# Altium schematic sheet Main.SchDoc
size 215 x 152 mm
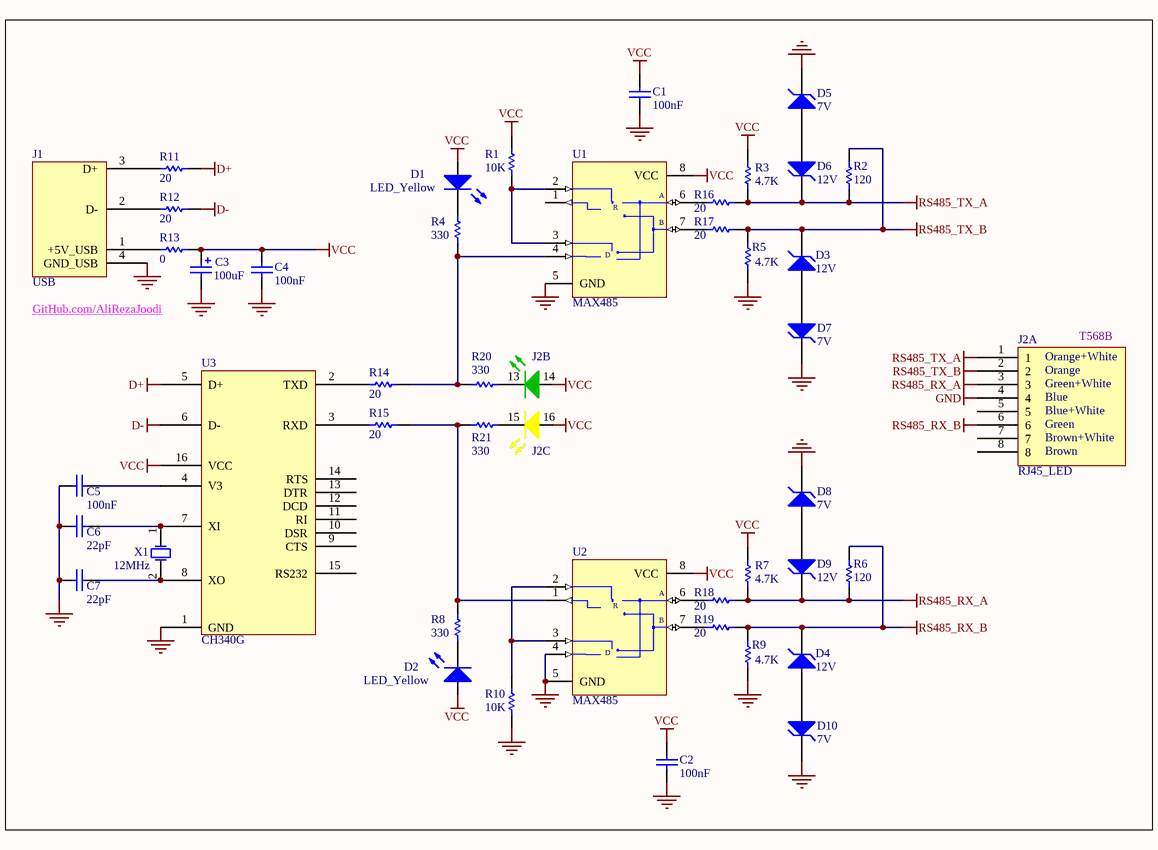
[diagram p0: Main.SchDoc]

## Parts
C1  100nF  [CAPNTO2.54-3.05x1.78A]
C2  100nF  [CAPNTO2.54-3.05x1.78A]
C3  100uF  [CAPPR2.5-6.3x5]
C4  100nF  [CAPNTO2.54-3.05x1.78A]
C5  100nF  [CAPNTO2.54-3.05x1.78A]
C6  22pF  [CAPNTO2.54-3.05x1.78A]
C7  22pF  [CAPNTO2.54-3.05x1.78A]
D1  LED_Yellow  [LED-5mm_Red]
D2  LED_Yellow  [LED-5mm_Red]
D3  12V  [DIODE0.4_Glass]
D4  12V  [DIODE0.4_Glass]
D5  7V  [DIODE0.4_Glass]
D6  12V  [DIODE0.4_Glass]
D7  7V  [DIODE0.4_Glass]
D8  7V  [DIODE0.4_Glass]
D9  12V  [DIODE0.4_Glass]
D10  7V  [DIODE0.4_Glass]
J1  USB  [USB2.5-2H4D]
J2  RJ45_LED  [RJ45-AMP_LED]  (parts A,B,C of 3)
R1  10K  [AXIAL-0.4]
R2  120  [AXIAL-0.4]
R3  4.7K  [AXIAL-0.4]
R4  330  [AXIAL-0.4]
R5  4.7K  [AXIAL-0.4]
R6  120  [AXIAL-0.4]
R7  4.7K  [AXIAL-0.4]
R8  330  [AXIAL-0.4]
R9  4.7K  [AXIAL-0.4]
R10  10K  [AXIAL-0.4]
R11  20  [AXIAL-0.4]
R12  20  [AXIAL-0.4]
R13  0  [AXIAL-0.4]
R14  20  [AXIAL-0.4]
R15  20  [AXIAL-0.4]
R16  20  [AXIAL-0.4]
R17  20  [AXIAL-0.4]
R18  20  [AXIAL-0.4]
R19  20  [AXIAL-0.4]
R20  330  [AXIAL-0.4]
R21  330  [AXIAL-0.4]
U1  MAX485  [PA8]
U2  MAX485  [PA8]
U3  CH340G  [SOIC127P602-16BM]
X1  12MHz  [XTAL_1]

## Nets
D+: R11.1 U3.5(D+)
D-: R12.1 U3.6(D-)
GND: C1.1 C2.1 C3.2 C4.1 C5.1 C6.2 C7.2 D5.2(K) D7.2(K) D8.2(K) D10.2(K) J1.4(GND_USB) J2.4 J2.10(H2) R5.2 R9.2 R10.1 U1.5(GND) U2.4(DI) U2.5(GND) U3.1(GND)
RS485_RX_A: D9.2(K) J2.3 R6.1 R7.2 R18.1
RS485_RX_B: D4.2(K) J2.6 R6.2 R9.1 R19.1
RS485_TX_A: D6.2(K) J2.1 R2.1 R3.2 R16.1
RS485_TX_B: D3.2(K) J2.2 R2.2 R5.1 R17.1
VCC: C1.2 C2.2 C3.1 C4.2 D1.1(A) D2.1(A) J2.14(A1) J2.16(A2) R1.2 R3.1 R7.1 R13.1 U1.8(VCC) U2.8(VCC) U3.16(VCC)
VDD: J2.9(H1)
NetC5_2: C5.2 U3.4(V3)
NetC6_1: C6.1 U3.7(XI) X1.1(OSC1)
NetC7_1: C7.1 U3.8(XO) X1.2(OSC2)
NetD1_2: D1.2(K) R4.2
NetD2_2: D2.2(K) R8.2
NetD3_1: D3.1(A) D7.1(A)
NetD4_1: D4.1(A) D10.1(A)
NetD5_1: D5.1(A) D6.1(A)
NetD8_1: D8.1(A) D9.1(A)
NetJ1_1: J1.1(+5V_USB) R13.2
NetJ1_2: J1.2(D-) R12.2
NetJ1_3: J1.3(D+) R11.2
NetJ2_13: J2.13(K1) R20.1
NetJ2_15: J2.15(K2) R21.1
NetR1_1: R1.1 U1.2(~{RE}) U1.3(DE)
NetR4_1: R4.1 R14.1 R20.2 U1.4(DI)
NetR8_1: R8.1 R15.1 R21.2 U2.1(RO)
NetR10_2: R10.2 U2.2(~{RE}) U2.3(DE)
NetR14_2: R14.2 U3.2(TXD)
NetR15_2: R15.2 U3.3(RXD)
NetR16_2: R16.2 U1.6(A)
NetR17_2: R17.2 U1.7(B)
NetR18_2: R18.2 U2.6(A)
NetR19_2: R19.2 U2.7(B)

Not connected (* = marked no-connect by the designer): J1 5(GND_USB) 6(GND_USB); J2 5 7 8 11(GND) 12(GND); U1 1(RO); U3 9(CTS) 10(DSR) 11(RI) 12(DCD) 13(DTR) 14(RTS) 15(RS232)

## Notes on the sheet
- GitHub.com/AliRezaJoodi
- (near J2) Orange+White
- (near J2) Orange
- T568B
- (near J2) Green+White
- (near J2) Blue
- (near J2) Blue+White
- (near J2) Green
- (near J2) Brown+White
- (near J2) Brown
- (in symbol MAX485CPA) R; D

## Library data of the parts
C1 C2 C4-C7 = Cap: Capacitor; Manufacturer: Generic Components; Class I: Passive; Published: 8-Jun-2000; Revision: July-2002: Re-released for DXP Platform.; Publisher: Altium Limited; Class II: Capacitor
C3 = Cap Pol1: Polarized Capacitor (Radial); Manufacturer: Generic Components; Class I: Passive; Published: 8-Jun-2000; Revision: July-2002: Re-released for DXP Platform.; Publisher: Altium Limited; Class II: Capacitor
D1 D2 = LED: Typical INFRARED GaAs LED; Manufacturer: Generic Components; Class I: Optoelectronic; Published: 8-Jun-2000; Revision: July-2002: Re-released for DXP Platform.; Publisher: Altium Limited; Class II: LED
D3-D10 = D Zener: Zener Diode; Manufacturer: Generic Components; Class I: Discrete; Class II: Diode - Zener; Published: 8-Jun-2000; Revision: July-2002: Re-released for DXP Platform.; Publisher: Altium Limited
R1-R21 = Res1: Resistor; Published: 8-Jun-2000; LatestRevisionDate: 17-Jul-2002; LatestRevisionNote: Re-released for DXP Platform.; PackageReference: AXIAL-0.3; Publisher: Altium Limited
U1 U2 = MAX485CPA: Low-Power, Slew-Rate-Limited RS-485/RS-422 Transceiver; Published: 16-Jan-2001; LatestRevisionDate: 29-May-2009; LatestRevisionNote: Component Body Added.; DatasheetVersion: Feb-1996; PackageVersion: RevB, 21-0043; PackageReference: PA8; Publisher: Altium Limited; PackageDescription: DIP, 8-Pin, Row Spacing 7.62 mm, Pitch 2.54 mm; Code_JEDEC: MS-001-AB; ComponentLink1Description: Manufacturer Link; ComponentLink1URL: http://www.maxim-ic.com/; ComponentLink2Description: Datasheet; ComponentLink2URL: http://pdfserv.maxim-ic.com/en/ds/MAX1487-MAX491.pdf
U3 = CH340G: USB to UART Interface
X1 = XTAL: Crystal Oscillator; Manufacturer: Generic Components; Published: 8-Jun-2000; Revision: July-2002: Re-released for DXP Platform.; Publisher: Altium Limited; Class I: Oscillator; Class II: Crystal Oscillator